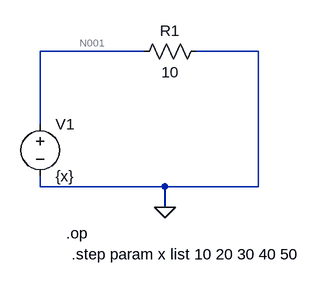
[diagram p0: schematic iter.asc]
iter.asc, the LTspice schematic file:
Version 4
SHEET 1 880 680
WIRE 400 128 240 128
WIRE 576 128 480 128
WIRE 240 240 240 128
WIRE 240 336 240 320
WIRE 432 336 240 336
WIRE 576 336 576 128
WIRE 576 336 432 336
WIRE 432 368 432 336
FLAG 432 368 0
SYMBOL Voltage 240 224 R0
SYMATTR InstName V1
SYMATTR Value {x}
SYMBOL Res 496 112 R90
WINDOW 0 0 56 VBottom 2
WINDOW 3 32 56 VTop 2
SYMATTR InstName R1
SYMATTR Value 10
TEXT 280 408 Left 2 !.op
TEXT 288 440 Left 2 !.step param x list 10 20 30 40 50

The netlist it stands for:
* iter.asc
V1 N001 0 {x}
R1 0 N001 10
.op
.step param x list 10 20 30 40 50
.backanno
.end

* Results of the author's LTspice run, read from the files saved beside the schematic
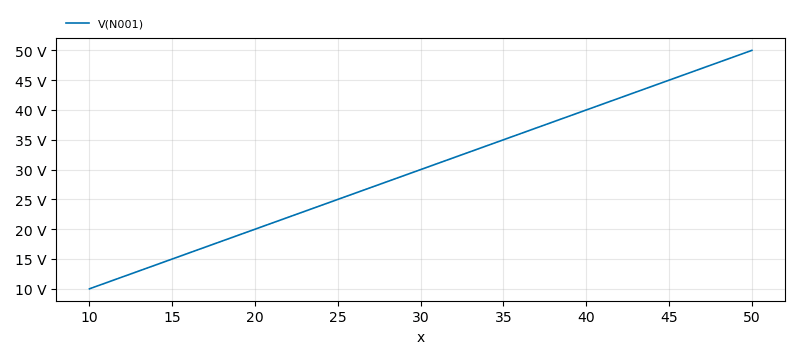
[diagram p1: Operating Point of iter.asc, plotted from the saved traces]
* Operating Point, 1 run:
*   V(N001): 10 V at x=10 , 50 V at x=50 , min 10 V, max 50 V